# Altium schematic sheet ADC.SchDoc
size A4
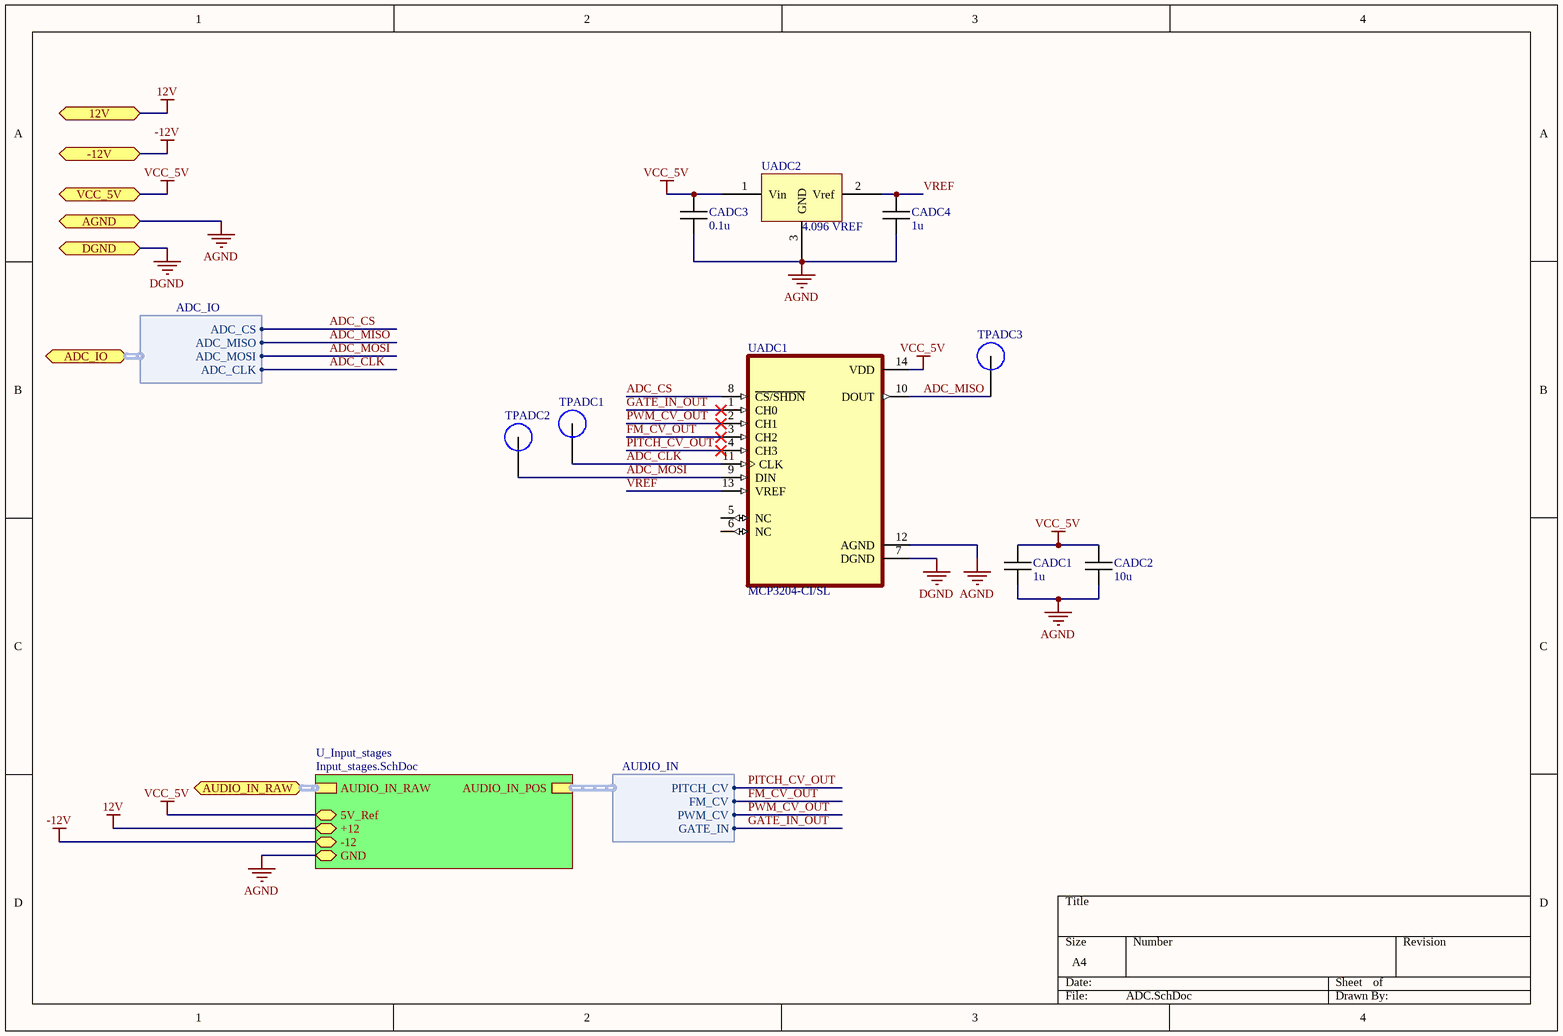
[diagram p0: ADC.SchDoc]

## Parts
CADC1  1u  [C 0603 / 1608]
CADC2  10u  [C 0603 / 1608]
CADC3  0.1u  [C 0603 / 1608]
CADC4  1u  [C 0603 / 1608]
TPADC1  Test Point  [Test POint]  (value not drawn)
TPADC2  Test Point  [Test POint]  (value not drawn)
TPADC3  Test Point  [Test POint]  (value not drawn)
UADC1  MCP3204-CI/SL  [SOIC-14]
UADC2  4.096 VREF  [SOT-23-3]

## Sub-sheets
U_Input_stages = Input_stages.SchDoc: GND (bidir), -12 (bidir), +12 (bidir), 5V_Ref (bidir), AUDIO_IN_POS (harness AUDIO_IN), AUDIO_IN_RAW (harness AUDIO_IN)

## Ports
12V (bidir), -12V (bidir), ADC_IO (bidir, harness ADC_IO), AGND (bidir), AUDIO_IN_RAW (bidir, harness AUDIO_IN), DGND (bidir), VCC_5V (bidir)

## Harnesses
ADC_IO: ADC_CS, ADC_MISO, ADC_MOSI, ADC_CLK
AUDIO_IN: PITCH_CV, FM_CV, PWM_CV, GATE_IN

## Nets
12V: port 12V, sheet U_Input_stages/+12
-12V: port -12V, sheet U_Input_stages/-12
AGND: CADC1.2 CADC2.2 CADC3.2 CADC4.2 UADC1.12(AGND) UADC2.3(GND) ; port AGND, sheet U_Input_stages/GND
DGND: UADC1.7(DGND) ; port DGND
VCC_5V: CADC1.1 CADC2.1 CADC3.1 UADC1.14(VDD) UADC2.1(Vin) ; port VCC_5V, sheet U_Input_stages/5V_Ref
ADC_CLK: TPADC1.1 UADC1.11(CLK) ; port ADC_IO.ADC_CLK
ADC_CS: UADC1.8(~{CS/SHDN}) ; port ADC_IO.ADC_CS
ADC_MISO: TPADC3.1 UADC1.10(DOUT) ; port ADC_IO.ADC_MISO
ADC_MOSI: TPADC2.1 UADC1.9(DIN) ; port ADC_IO.ADC_MOSI
FM_CV_OUT: UADC1.3(CH2) ; sheet U_Input_stages/AUDIO_IN_POS.FM_CV
GATE_IN_OUT: UADC1.1(CH0) ; sheet U_Input_stages/AUDIO_IN_POS.GATE_IN
PITCH_CV_OUT: UADC1.4(CH3) ; sheet U_Input_stages/AUDIO_IN_POS.PITCH_CV
PWM_CV_OUT: UADC1.2(CH1) ; sheet U_Input_stages/AUDIO_IN_POS.PWM_CV
VREF: CADC4.1 UADC1.13(VREF) UADC2.2(Vref)

Not connected (* = marked no-connect by the designer): UADC1 5(NC) 6(NC)

## Buses and harness runs
harness port AUDIO_IN_RAW = sheet U_Input_stages/AUDIO_IN_RAW

## Library data of the parts
CADC1-CADC4 = Capacitor
  CADC1 CADC4: Value: 1u
  CADC2: Value: 10u
  CADC3: Value: 0.1u
UADC1 = MCP3204-CI/SL: 12 Bit Analog to Digital Converter 2, 4 Input 1 SAR 14-SOIC; MF: Microchip; Price: None; SnapEDA_Link: https://www.snapeda.com/parts/MCP3204-CI/SL/Microchip/view-part/62/?ref=snap; Value: *; Package: SOIC-14 Microchip; Availability: Unavailable; MP: MCP3204-CI/SL
UADC2 = MCP1541: 4.096 Voltage reference